# Altium schematic sheet BrushlessDriver.SchDoc: Brushless Driver, 48V Max, 3.5A Continuous
size A; DrawnBy: Brent; DocumentNumber: XXXXXX; Revision: A; SheetNumber: 1; SheetTotal: 8
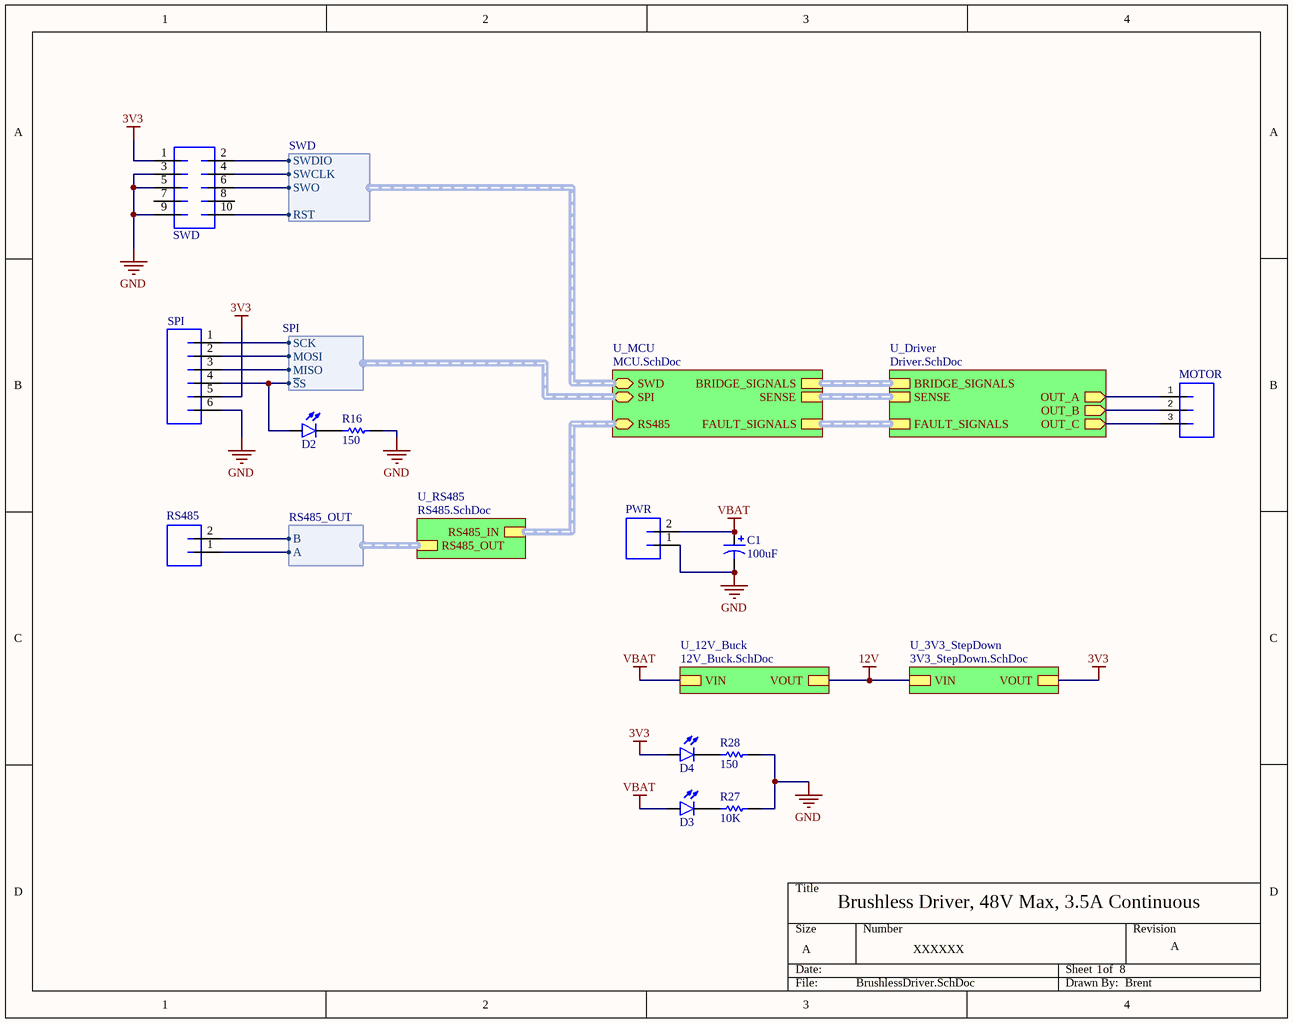
[diagram p0: BrushlessDriver.SchDoc]

## Parts
C1  value 100uF  [CAP-ELECTROLYTIC[10.0x12.6]]  (hidden comment: 100uF 63V)
D2  LED_0603_GREEN_5mA  [LED0603]  (value not drawn)
D3  LED_0603_ORANGE_5mA  [LED0603]  (value not drawn)
D4  LED_0603_GREEN_5mA  [LED0603]  (value not drawn)
MOTOR  MotorConnector  [MotorConnector]  (value not drawn)
PWR  MOLEX_MICROFIT_2_SMD_HORZ  [MOLEX-MICROFIT-2-SMD-HORZ]  (value not drawn)
R16  150  [RESC0603(1608)_L]
R27  10K  [RESC0603(1608)_N]
R28  150  [RESC0603(1608)_L]
RS485  JST_PH_2_VERT  [JST-PH-2-PTH-VERT]  (value not drawn)
SPI  JST_PH_6_VERT  [JST-PH-6-PTH-VERT]  (value not drawn)
SWD  1.27mm SWD Connector  [SWD-SMD]  (value not drawn)

## Sub-sheets
U_3V3_StepDown = 3V3_StepDown.SchDoc: VIN, VOUT
U_12V_Buck = 12V_Buck.SchDoc: VIN, VOUT
U_Driver = Driver.SchDoc: OUT_A (out), OUT_B (out), OUT_C (out), BRIDGE_SIGNALS (harness BRIDGE_SIG), SENSE (harness PHASE_SENSE), FAULT_SIGNALS (harness FAULT_SIG)
U_MCU = MCU.SchDoc: BRIDGE_SIGNALS (harness BRIDGE_SIG), FAULT_SIGNALS (harness FAULT_SIG), SENSE (harness PHASE_SENSE), SWD (harness SWD), SPI (harness SPI), RS485 (harness RS485_IN)
U_RS485 = RS485.SchDoc: RS485_IN (harness RS485_IN), RS485_OUT (harness RS485_OUT)

## Harnesses
SPI: SCK, MOSI, MISO, ~{S}S
RS485_OUT: A, B
SWD: SWCLK, SWDIO, RST, SWO

## Nets
3V3: D4.A SPI.5 SWD.1 ; sheet U_3V3_StepDown/VOUT
12V: sheet U_12V_Buck/VOUT, sheet U_3V3_StepDown/VIN
GND: C1.2 PWR.1 R16.1 R27.2 R28.1 SPI.6 SWD.3 SWD.5 SWD.9
VBAT: C1.1 D3.A PWR.2 ; sheet U_12V_Buck/VIN
NetD2_A: D2.A SPI.4 ; sheet U_MCU/SPI.~{S}S
NetD2_C: D2.C R16.2
NetD3_C: D3.C R27.1
NetD4_C: D4.C R28.2
NetMOTOR_1: MOTOR.1 ; sheet U_Driver/OUT_A
NetMOTOR_2: MOTOR.2 ; sheet U_Driver/OUT_B
NetMOTOR_3: MOTOR.3 ; sheet U_Driver/OUT_C
NetRS485_1: RS485.1 ; sheet U_RS485/RS485_OUT.A
NetRS485_2: RS485.2 ; sheet U_RS485/RS485_OUT.B
NetSPI_1: SPI.1 ; sheet U_MCU/SPI.SCK
NetSPI_2: SPI.2 ; sheet U_MCU/SPI.MOSI
NetSPI_3: SPI.3 ; sheet U_MCU/SPI.MISO
NetSWD_2: SWD.2 ; sheet U_MCU/SWD.SWDIO
NetSWD_4: SWD.4 ; sheet U_MCU/SWD.SWCLK
NetSWD_6: SWD.6 ; sheet U_MCU/SWD.SWO
NetSWD_10: SWD.10 ; sheet U_MCU/SWD.RST

Not connected (* = marked no-connect by the designer): SWD 7 8

## Buses and harness runs
harness sheet U_Driver/BRIDGE_SIGNALS = sheet U_MCU/BRIDGE_SIGNALS
harness sheet U_Driver/FAULT_SIGNALS = sheet U_MCU/FAULT_SIGNALS
harness sheet U_Driver/SENSE = sheet U_MCU/SENSE
harness sheet U_MCU/RS485 = sheet U_RS485/RS485_IN

## Library data of the parts
C1 = CAP_100uF_63V_20%: 100uF 63V 20%; PartNumber: PCR1J101MCL1GS; Manufacturer: Nichicon; Mounting Technology: Surface Mount; PackageReference: 1H; PackageDescription: 10x12.7mm; Voltage: 63V; Tolerance: 20%
D2 D4 = LED_0603_GREEN_5mA: PartNumber: LTST-C193TGKT-5A; Manufacturer: Lite-On Inc.; PackageReference: 0603; PackageDescription: 0603 (1608 Metric); Mounting Technology: Surface Mount
D3 = LED_0603_ORANGE_5mA: PartNumber: LTST-C193KFKT-5A; Manufacturer: Lite-On Inc.; PackageReference: 0603; PackageDescription: 0603 (1608 Metric); Mounting Technology: Surface Mount
PWR = MOLEX_MICROFIT_2_SMD_HORZ: Manufacturer: Molex; PartNumber: 43650-0212; Mounting Technology: Surface Mount; PackageReference: Microfit-3.0mm
R16 R28 = CMP-1012-00415-1: 150R 0.1W 1% 0603 (1608 Metric)  SMD; Case-Metric: 1608; Value: 150.00 Ohm; Case-EIA: 0603; Tolerance: 1 %; Power: 0.1 W; Technology: SMT
R27 = CMP-1012-00623-1: 10K 0.1W 1% 0603 (1608 Metric)  SMD; Value: 10000.00 Ohm; Case-EIA: 0603; Case-Metric: 1608; Power: 0.1 W; Tolerance: 1 %; Technology: SMT
RS485 = JST_PH_2_VERT: Manufacturer: JST Sales America, Inc.; PartNumber: B2B-PH-K-S(LF)(SN); Mounting Technology: Through Hole; PackageReference: JST-PH
SPI = JST_PH_6_VERT: PartNumber: B6B-PH-K-S(LF)(SN); Manufacturer: JST Sales America Inc.; PackageReference: JST-PH; Mounting Technology: Through Hole
SWD = SWD: Manufacturer: Samtec; PartNumber: FTSH-105-01-F-DV; Mounting Technology: SMD; PackageReference: Header-1.27mm-2x5